# Altium schematic sheet repeat schematic.SchDoc
size A
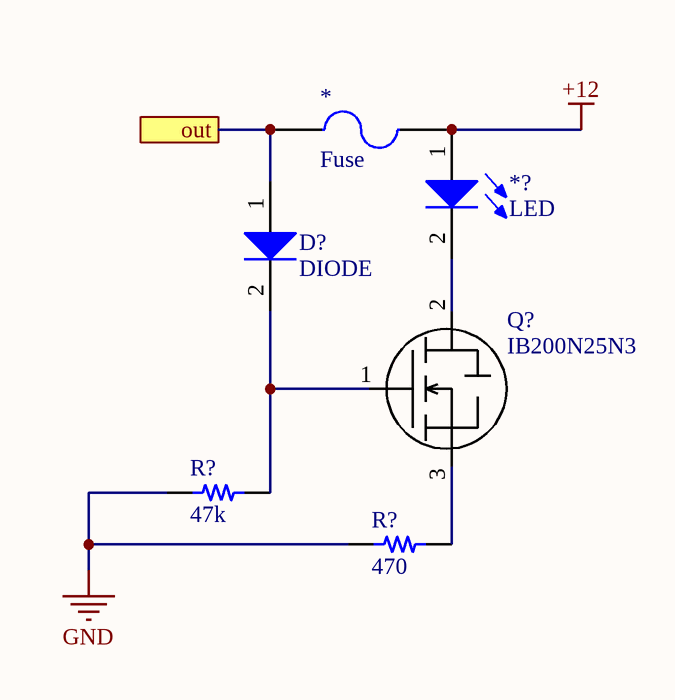
[diagram p0: repeat schematic.SchDoc]

## Parts
(Parts that share a designator on the sheet are numbered #1, #2 ... from top to bottom, then left to right.)
*  Fuse
*?  LED  [0805_LED]
D?  DIODE  [SODFL350X115-2M]
Q?  IB200N25N3  [DPAK254P1524X457-3N]
R?#1  value 47k  [RES 0805/2012]  (hidden comment: Resistor 47k 0805 1/10W 1%)
R?#2  value 470  [RES 0805/2012]  (hidden comment: Resistor 470 0805 1/10W 1%)

## Ports
out

## Nets
+12: *.2 *?.1(A)
GND: R?#1.2 R?#2.2
out: *.1 D?.1(A) ; port out
Net*?_2: *?.2(K) Q?.2(D)
NetD?_2: D?.2(K) Q?.1(Gate) R?#1.1
NetQ?_3: Q?.3(Source) R?#2.1

## Library data of the parts
*? = 1: idLED: 1; Name: LED_0805_RED; Value: Red; Vf: 0.7V; Manufacturer_id: 1; Drawer_id: 1
D? = 2: Diode Super Barrier 40V 1A Surface Mount SOD-123F; Manufacturer_id: 1; MfrPartNo: 1N5819HW1-7-F; idDiode: 2; Name: 1N5819; Drawer_id: 1; Value: 1A; Type: Super Barrier; Num_Circuits: 1; Ic: 1A; Power: 40V; Package: SOD-123; Link: https://www.digikey.com/product-detail/en/diodes-incorporated/1N5819HW1-7-F/1N5819HW1-7-FDITR-ND/5768523; ComponentLink1Description: Datasheet; ComponentLink1URL: https://www.diodes.com/assets/Datasheets/1N5819HW1.pdf; Supplier1: Digi-Key; Supplier1PartNo: 1N5819HW1-7-FDITR-ND
Q? = 1: MOSFET N-Ch 250V 64A D2PAK-2 OptiMOS 3; MfrPartNo: IPB200N25N3; idFETs: 1; Name: TO-263-3_64A; Value: 250V_64A; Rds_On: 20m; Vgs(Max): 20V; Power(Max): 300W; ComponentLink1Description: Mouser Part; ComponentLink1URL: https://www.mouser.com/ProductDetail/Infineon-Technologies/IPB200N25N3-G?qs=sGAEpiMZZMshyDBzk1%2fWi5eGkr%252bPRUK3FK%2fjPTagUYc%3d; Manufacturer_id: 1; Drawer_id: 1; Vdss: 250V; Num_Circuits: 1; Id: 64A; Package: TO-263-3; Link: https://www.mouser.com/ProductDetail/Infineon-Technologies/IPB200N25N3-G?qs=sGAEpiMZZMshyDBzk1%2fWi5eGkr%252bPRUK3FK%2fjPTagUYc%3d; Supplier1: Mouser; Supplier1PartNo: 726-IPB200N25N3GXT
R?#1 = 545: Manufacturer_id: 1; idResistor: 545; Name: Res_47k_0805_1/10W_1%; Created_By: Nick Mah; Supplier 1: Digi-Key; Drawer_id: 1; Tolerance: 1%; Power: 1/10W; Package: 0805; ComponentLink1Description: Datasheet; Created_Date: 2018-10-20
R?#2 = 497: Manufacturer_id: 1; idResistor: 497; Name: Res_470_0805_1/10W_1%; Created_By: Nick Mah; Supplier 1: Digi-Key; Drawer_id: 1; Tolerance: 1%; Power: 1/10W; Package: 0805; ComponentLink1Description: Datasheet; Created_Date: 2018-10-20